# EAGLE design LightSensor (EAGLE 7.1.0)
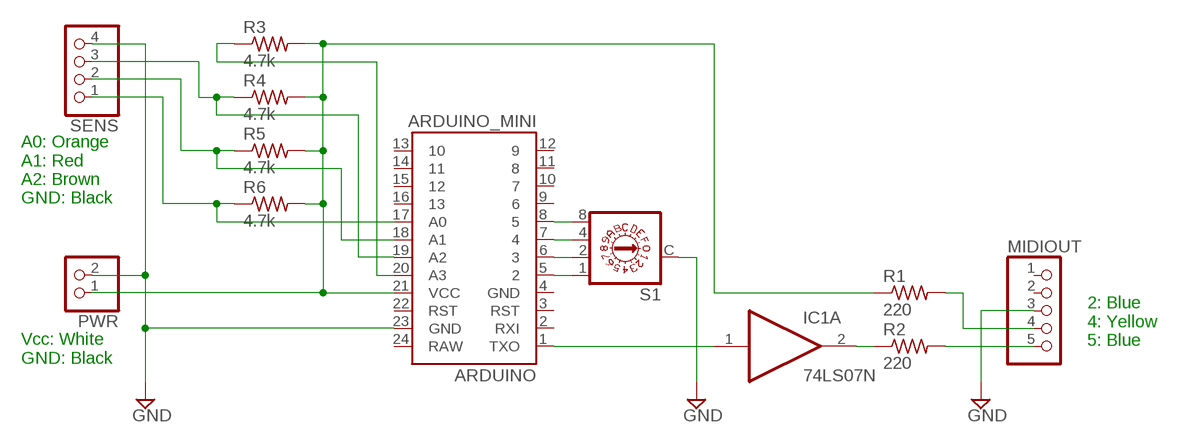
[diagram p0: schematic, sheet 1]

## Parts
ARDUINO  ARDUINO_MINI  [ARDUINO_MINI]
IC1  74LS07N  [DIL14]
MIDIOUT  PINHD-1X5  [1X05]
PWR  PINHD-1X2  [1X02]
R1  220  R-US_0204/5  [0204/5]
R2  220  R-US_0204/5  [0204/5]
R3  4.7k  R-US_0204/5  [0204/5]
R4  4.7k  R-US_0204/5  [0204/5]
R5  4.7k  R-US_0204/5  [0204/5]
R6  4.7k  R-US_0204/5  [0204/5]
S1  A1353HEX  [A1353HEX]
SENS  PINHD-1X4  [1X04]

## Nets
GND: ARDUINO.23(GND) MIDIOUT.3 PWR.2 S1.C SENS.4
N$1: ARDUINO.1(TXO) IC1.1(A:I)
N$2: IC1.2(A:O) R2.1
N$3: ARDUINO.21(VCC) PWR.1 R1.1 R3.2 R4.2 R5.2 R6.2
N$4: MIDIOUT.5 R2.2
N$5: MIDIOUT.4 R1.2
N$6: ARDUINO.20(A3) R3.1
N$7: ARDUINO.19(A2) R4.1 SENS.3
N$8: ARDUINO.18(A1) R5.1 SENS.2
N$9: ARDUINO.17(A0) R6.1 SENS.1
N$10: ARDUINO.5 S1.1
N$11: ARDUINO.6 S1.2
N$12: ARDUINO.7 S1.4
N$13: ARDUINO.8 S1.8
Unconnected: ARDUINO.2(RXI) ARDUINO.3(RST) ARDUINO.4(GND) ARDUINO.9 ARDUINO.10 ARDUINO.11 ARDUINO.12 ARDUINO.13 ARDUINO.14 ARDUINO.15 ARDUINO.16 ARDUINO.22(RST) ARDUINO.24(RAW) IC1.3(B:I) IC1.4(B:O) IC1.5(C:I) IC1.6(C:O) IC1.8(D:O) IC1.9(D:I) IC1.10(E:O) IC1.11(E:I) IC1.12(F:O) IC1.13(F:I) MIDIOUT.1 MIDIOUT.2

## Notes on the sheet
- A0: Orange
  A1: Red
  A2: Brown
  GND: Black
- 2: Blue
  4: Yellow
  5: Blue
- Vcc: White
  GND: Black

## Power pins joined to a net without a drawn wire
GND: IC1.7(P:GND)
VCC: IC1.14(P:VCC)

## Library data of the parts
ARDUINO = SparkFun-Boards:ARDUINO_MINI: Arduino Pro Mini footprint
IC1 = 74xx-us:74*07: Hex BUFFER, open collector high-voltage output
MIDIOUT = pinhead:PINHD-1X5: PIN HEADER
PWR = pinhead:PINHD-1X2: PIN HEADER
R1-R6 = resistor:R-US_: RESISTOR, American symbol
S1 = switch-dil:A1353HEX: DIL/CODE SWITCH; OC_FARNELL: unknown; OC_NEWARK: unknown
SENS = pinhead:PINHD-1X4: PIN HEADER

## Board
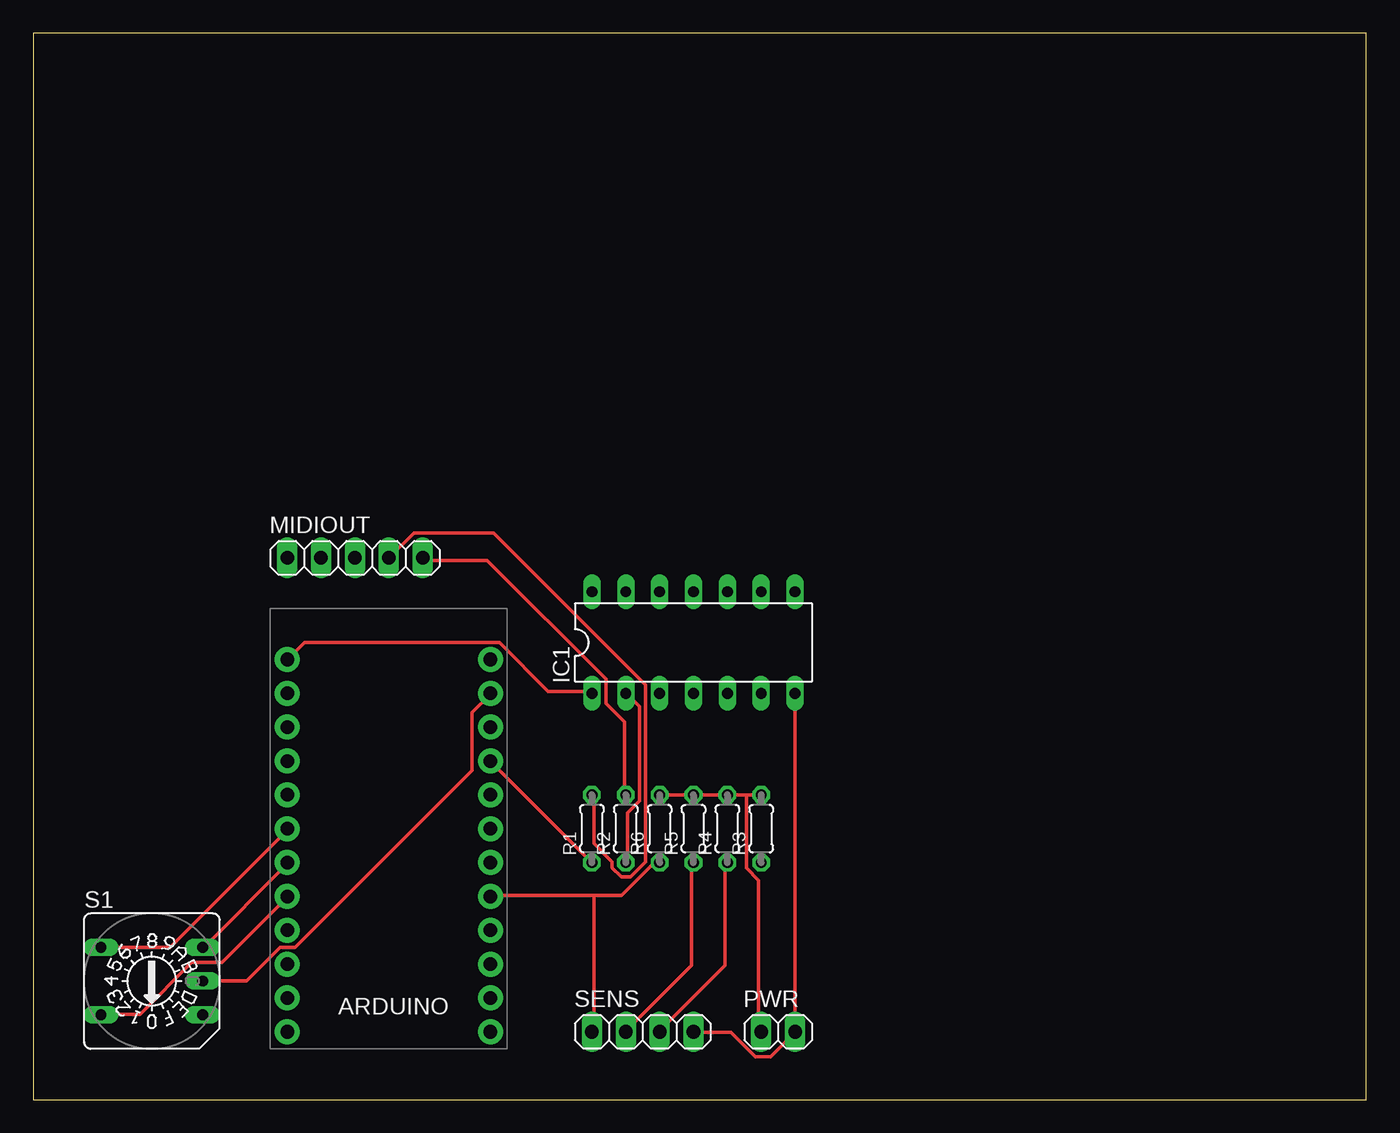
[diagram p1: board, top side]
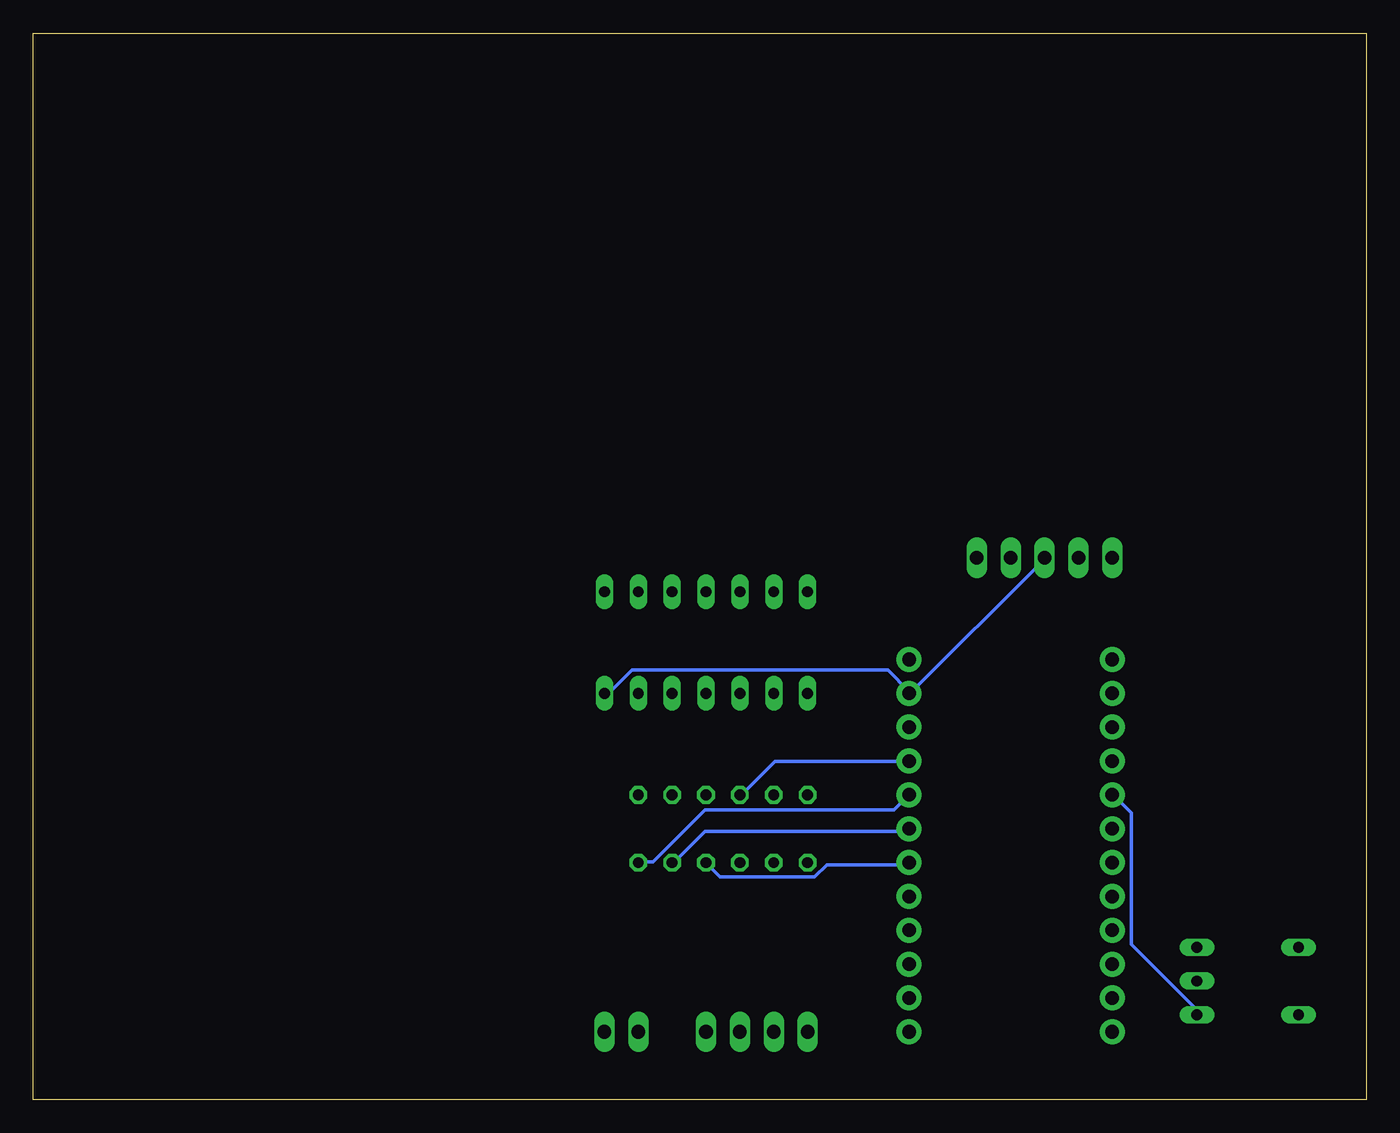
[diagram p2: board, bottom side, seen from below]

Size 100 x 80 mm. Coordinates in mm from the lower left corner, seen from the top.
Outline: 0,0 100,0 100,80 0,80 0,0
Copper layers (1*16): Top 0.035mm / dielectric 1.5mm / Bottom 0.035mm
Design rules "default": minimum track width 10mil, minimum drill 24mil, track to track 8mil, track to pad 8mil, pad to pad 8mil, via to via 8mil, smd to smd 8mil, copper to edge 40mil, drill to drill 8mil, minimum pad ring 10mil, minimum via ring 8mil, stop-mask expansion 4mil, vias tented up to drill 0mil, thermal gap 10mil

### Footprints (pad centres in the part's own frame; a part is rotated, then mirrored left to right if it is on the bottom)
ARDUINO_MINI = drill 1.016 pad 1.88: 1 -7.62,12.7; 2 -7.62,10.16; 3 -7.62,7.62; 4 -7.62,5.08; 5 -7.62,2.54; 6 -7.62,0; 7 -7.62,-2.54; 8 -7.62,-5.08; 9 -7.62,-7.62; 10 -7.62,-10.16; 11 -7.62,-12.7; 12 -7.62,-15.24; 13 7.62,-15.24; 14 7.62,-12.7; 15 7.62,-10.16; 16 7.62,-7.62; 17 7.62,-5.08; 18 7.62,-2.54; 19 7.62,0; 20 7.62,2.54; 21 7.62,5.08; 22 7.62,7.62; 23 7.62,10.16; 24 7.62,12.7
DIL14 = drill 0.813 long: 1 -7.62,-3.81; 2 -5.08,-3.81; 3 -2.54,-3.81; 4 0,-3.81; 5 2.54,-3.81; 6 5.08,-3.81; 7 7.62,-3.81; 8 7.62,3.81; 9 5.08,3.81; 10 2.54,3.81; 11 0,3.81; 12 -2.54,3.81; 13 -5.08,3.81; 14 -7.62,3.81
1X05 = drill 1.016 long: 1 -5.08,0; 2 -2.54,0; 3 0,0; 4 2.54,0; 5 5.08,0
1X02 = drill 1.016 long: 1 -1.27,0; 2 1.27,0
0204/5 = drill 0.813 octagon: 1 -2.54,0; 2 2.54,0
A1353HEX = drill 0.813 long: 1 3.81,-2.54; 2 -3.81,2.54; 4 3.81,2.54; 8 -3.81,-2.54; C 3.81,0
1X04 = drill 1.016 long: 1 -3.81,0; 2 -1.27,0; 3 1.27,0; 4 3.81,0

### Placement (x,y rotation side)
ARDUINO  26.67,20.32 0 top
IC1  49.53,34.29 0 top
MIDIOUT  24.13,40.64 0 top
PWR  55.88,5.08 0 top
R1  41.91,20.32 90 top
R2  44.45,20.32 90 top
R3  54.61,20.32 90 top
R4  52.07,20.32 90 top
R5  49.53,20.32 90 top
R6  46.99,20.32 90 top
S1  8.89,8.89 0 top
SENS  45.72,5.08 0 top

### Tracks (layer width: path | path; a pad name or v marks a point on that pad's centre or on a via)
GND
  Top 0.254: SENS.4 49.61,5.03 52.35,5.03 54.18,3.2 55.32,3.2 57.15,5.03 PWR.2 IC1.7 | S1.C 12.8,8.91 16,8.91 18.52,11.43 19.66,11.43 32.92,24.69 32.92,29.03 34.29,30.4 ARDUINO.23
  Bottom 0.254: IC1.7 57.15,30.63 56.69,30.63 55.09,32.23 35.89,32.23 34.29,30.63 ARDUINO.23 34.29,30.4 24.23,40.46 MIDIOUT.3
N$1
  Top 0.254: IC1.1 41.83,30.63 38.63,30.63 34.98,34.29 20.34,34.29 19.2,33.15 ARDUINO.1
N$2
  Top 0.254: R2.1 44.58,17.83 44.58,21.49 45.49,22.4 45.49,29.49 44.58,30.4 IC1.2
N$3
  Top 0.254: R1.1 41.83,17.83 34.29,25.38 ARDUINO.21 | R6.2 R5.2 R4.2 53.49,22.86 | R3.2 53.49,22.86 | 53.49,22.86 53.49,17.37 54.41,16.46 54.41,5.26 PWR.1
  Bottom 0.254: ARDUINO.21 34.29,25.38 44.35,25.38 46.86,22.86 R6.2
N$4
  Top 0.254: R2.2 44.35,22.86 44.35,28.35 42.98,29.72 42.98,31.55 34.06,40.46 29.26,40.46 MIDIOUT.5
N$5
  Top 0.254: R1.2 42.06,22.86 42.06,19.2 43.43,17.83 43.43,17.37 44.12,16.69 44.81,16.69 45.95,17.83 45.95,31.09 34.52,42.52 28.57,42.52 26.75,40.69 MIDIOUT.4
N$6
  Bottom 0.254: ARDUINO.20 35.43,21.72 49.61,21.72 53.49,17.83 54.41,17.83 R3.1
N$7
  Top 0.254: R4.1 51.89,17.6 51.89,10.06 47.09,5.26 SENS.3
  Bottom 0.254: ARDUINO.19 34.29,20.12 49.61,20.12 51.89,17.83 R4.1
N$8
  Top 0.254: R5.1 49.38,17.6 49.38,10.06 44.58,5.26 SENS.2
  Bottom 0.254: ARDUINO.18 34.29,17.6 40.46,17.6 41.38,16.69 48.46,16.69 49.38,17.6 R5.1
N$9
  Top 0.254: 42.06,15.32 34.29,15.32 ARDUINO.17 | 42.06,15.32 44.12,15.32 46.41,17.6 46.86,17.6 R6.1 | 42.06,15.32 42.06,5.26 SENS.1
N$10
  Bottom 0.254: S1.1 12.8,6.4 12.8,6.86 17.6,11.66 17.6,21.49 18.97,22.86 ARDUINO.5
N$11
  Top 0.254: S1.2 10.29,11.43 18.97,20.12 ARDUINO.6
N$12
  Top 0.254: S1.4 12.8,11.43 18.97,17.6 ARDUINO.7
N$13
  Top 0.254: S1.8 5.26,6.4 8,6.4 11.89,10.29 14.17,10.29 18.97,15.09 ARDUINO.8